# EAGLE design LTC6811_slave_12s_rev3 (EAGLE 9.3.0)
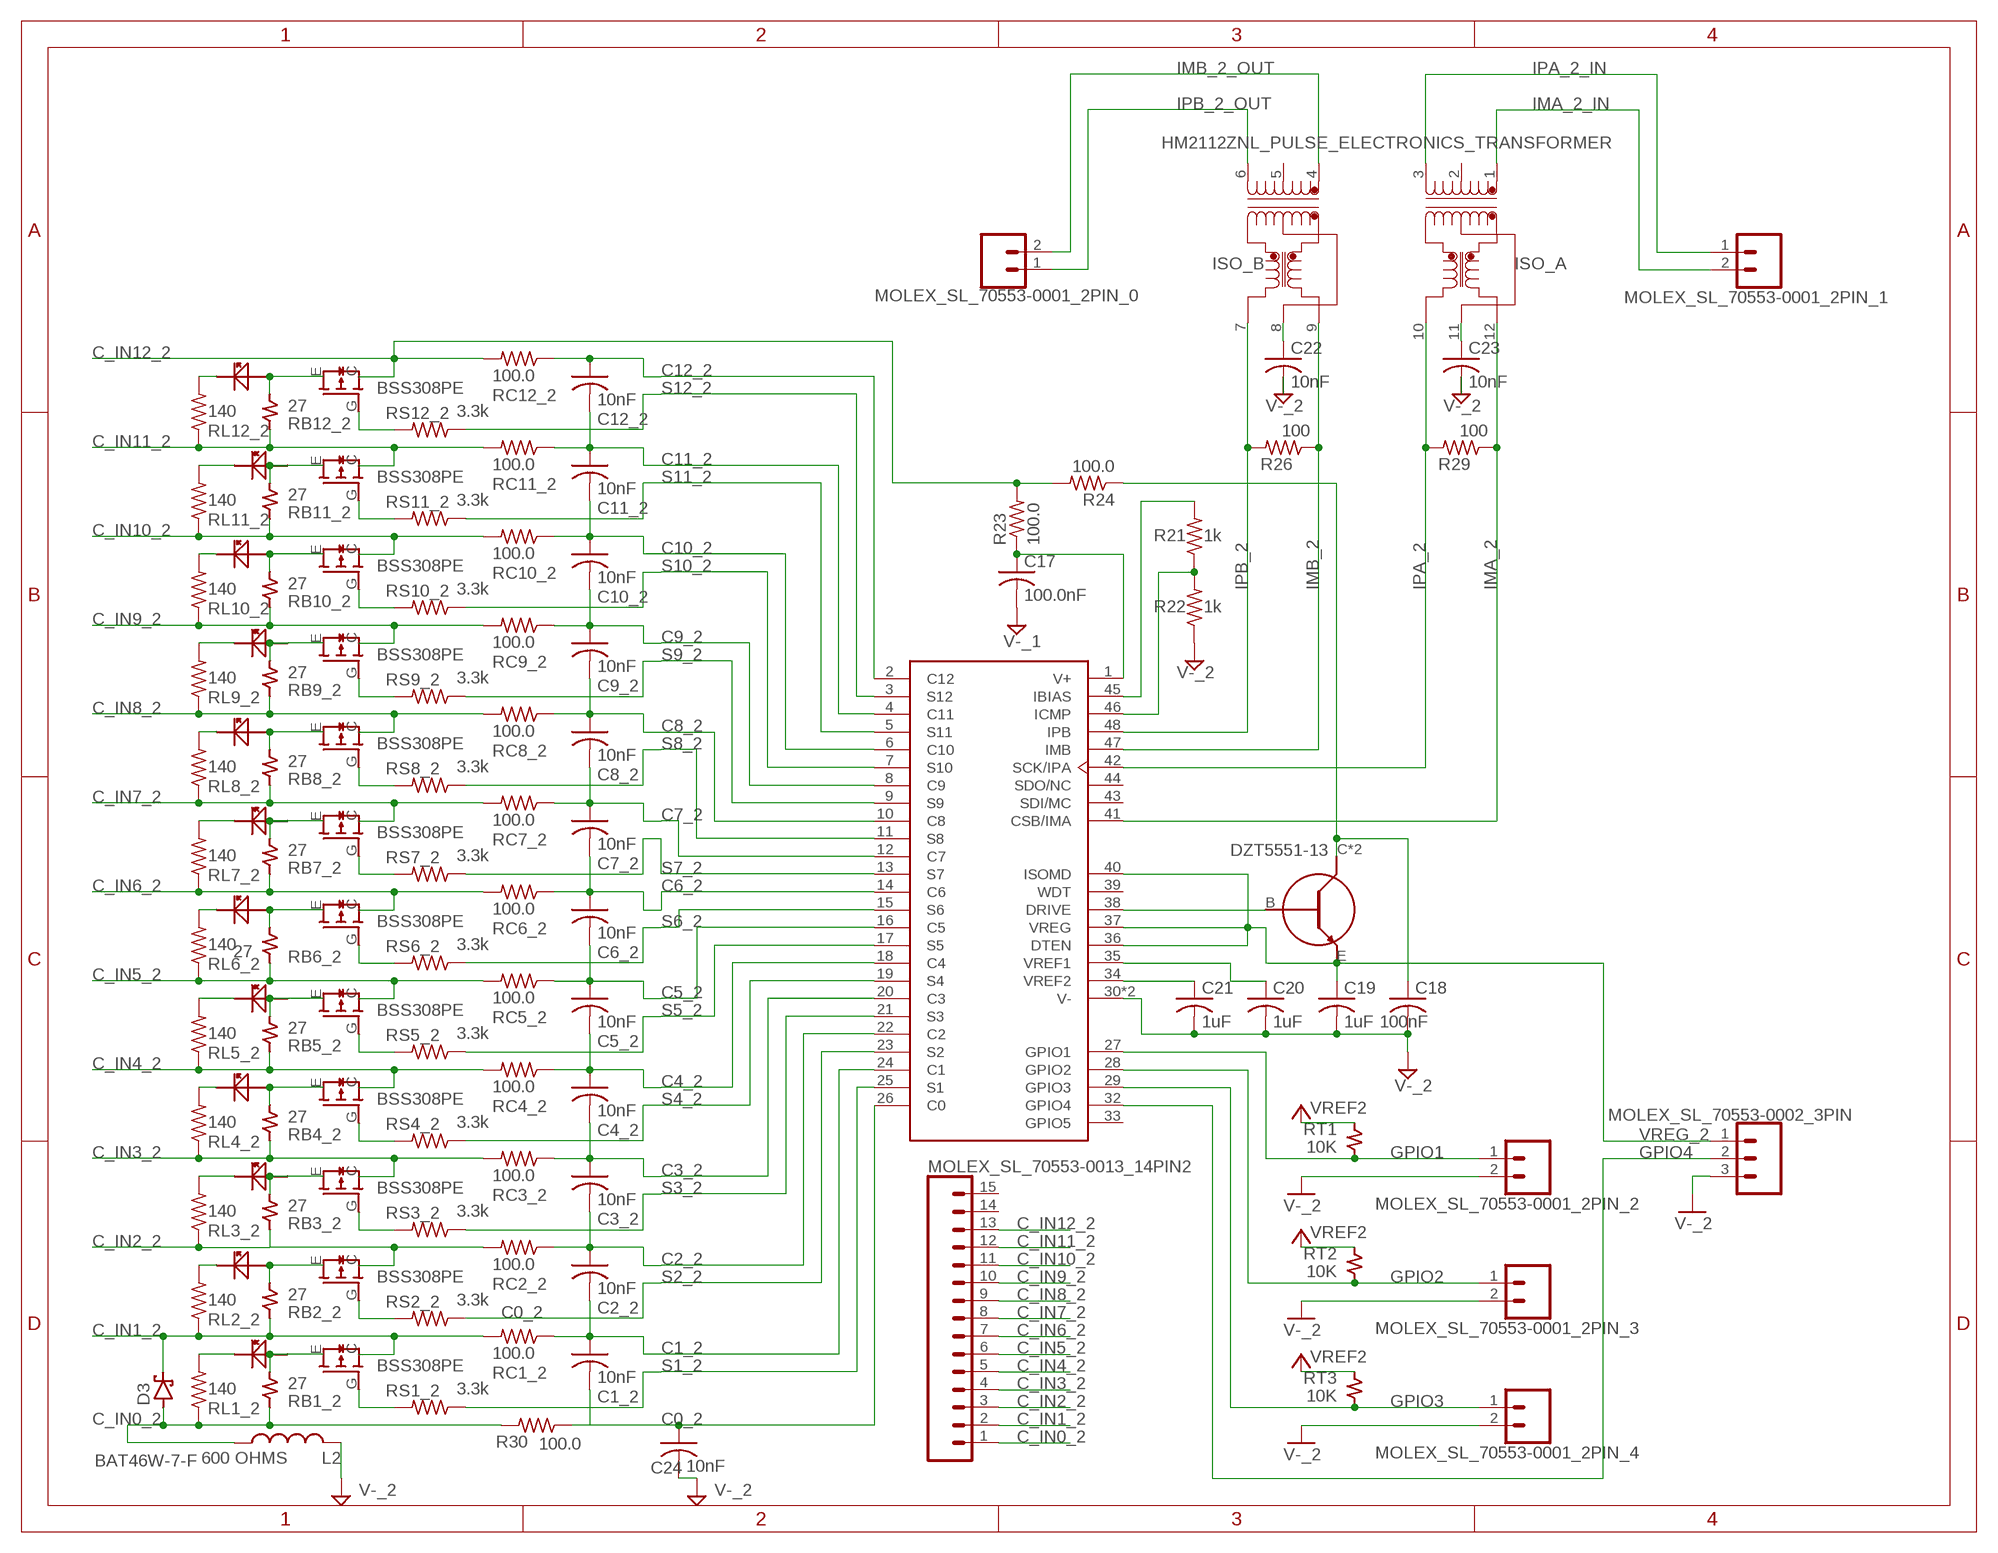
[diagram p0: schematic, sheet 1]

## Parts
C1_2  10nF  C-USC0805  [C0805]
C2_2  10nF  C-USC0805  [C0805]
C3_2  10nF  C-USC0805  [C0805]
C4_2  10nF  C-USC0805  [C0805]
C5_2  10nF  C-USC0805  [C0805]
C6_2  10nF  C-USC0805  [C0805]
C7_2  10nF  C-USC0805  [C0805]
C8_2  10nF  C-USC0805  [C0805]
C9_2  10nF  C-USC0805  [C0805]
C10_2  10nF  C-USC0805  [C0805]
C11_2  10nF  C-USC0805  [C0805]
C12_2  10nF  C-USC0805  [C0805]
C17  100.0nF  C-USC0805  [C0805]
C18  100nF  C-USC0805  [C0805]
C19  1uF  C-USC0805  [C0805]
C20  1uF  C-USC0805  [C0805]
C21  1uF  C-USC0805  [C0805]
C22  10nF  C-USC0805  [C0805]
C23  10nF  C-USC0805  [C0805]
C24  10nF  C-USC0805  [C0805]
D3  BAT46W-7-F  [SOD123]
DZT5551-2  DZT5551-13  [SOT223-4]
L2  600 OHMS  0805_FERRITEBEAD_INDUCTOR  [0805_COMPONENT]
LED1_25  LED_0805  [0805_COMPONENT]
LED1_26  LED_0805  [0805_COMPONENT]
LED1_27  LED_0805  [0805_COMPONENT]
LED1_28  LED_0805  [0805_COMPONENT]
LED1_29  LED_0805  [0805_COMPONENT]
LED1_30  LED_0805  [0805_COMPONENT]
LED1_31  LED_0805  [0805_COMPONENT]
LED1_32  LED_0805  [0805_COMPONENT]
LED1_33  LED_0805  [0805_COMPONENT]
LED1_34  LED_0805  [0805_COMPONENT]
LED1_35  LED_0805  [0805_COMPONENT]
LED1_36  LED_0805  [0805_COMPONENT]
MOLEX_SL_70553-0001_2PIN_0  CONN_02  [1X02]
MOLEX_SL_70553-0001_2PIN_1  CONN_02  [1X02]
MOLEX_SL_70553-0001_2PIN_2  CONN_02  [1X02]
MOLEX_SL_70553-0001_2PIN_3  CONN_02  [1X02]
MOLEX_SL_70553-0001_2PIN_4  CONN_02  [1X02]
MOLEX_SL_70553-0002_3PIN  CONN_03  [1X03]
MOLEX_SL_70553-0013_14PIN2  CONN_15  [1X15]
R21  1k  R-US_R0805  [R0805]
R22  1k  R-US_R0805  [R0805]
R23  100.0  R-US_R0805  [R0805]
R24  100.0  R-US_R0805  [R0805]
R26  100  R-US_R0805  [R0805]
R29  100  R-US_R0805  [R0805]
R30  100.0  R-US_R0805  [R0805]
RB1_2  27  2817_RESISTOR  [2817_COMPONENT]
RB2_2  27  2817_RESISTOR  [2817_COMPONENT]
RB3_2  27  2817_RESISTOR  [2817_COMPONENT]
RB4_2  27  2817_RESISTOR  [2817_COMPONENT]
RB5_2  27  2817_RESISTOR  [2817_COMPONENT]
RB6_2  27  2817_RESISTOR  [2817_COMPONENT]
RB7_2  27  2817_RESISTOR  [2817_COMPONENT]
RB8_2  27  2817_RESISTOR  [2817_COMPONENT]
RB9_2  27  2817_RESISTOR  [2817_COMPONENT]
RB10_2  27  2817_RESISTOR  [2817_COMPONENT]
RB11_2  27  2817_RESISTOR  [2817_COMPONENT]
RB12_2  27  2817_RESISTOR  [2817_COMPONENT]
RC1_2  100.0  R-US_R0805  [R0805]
RC2_2  100.0  R-US_R0805  [R0805]
RC3_2  100.0  R-US_R0805  [R0805]
RC4_2  100.0  R-US_R0805  [R0805]
RC5_2  100.0  R-US_R0805  [R0805]
RC6_2  100.0  R-US_R0805  [R0805]
RC7_2  100.0  R-US_R0805  [R0805]
RC8_2  100.0  R-US_R0805  [R0805]
RC9_2  100.0  R-US_R0805  [R0805]
RC10_2  100.0  R-US_R0805  [R0805]
RC11_2  100.0  R-US_R0805  [R0805]
RC12_2  100.0  R-US_R0805  [R0805]
RL1_2  140  R-US_R0805  [R0805]
RL2_2  140  R-US_R0805  [R0805]
RL3_2  140  R-US_R0805  [R0805]
RL4_2  140  R-US_R0805  [R0805]
RL5_2  140  R-US_R0805  [R0805]
RL6_2  140  R-US_R0805  [R0805]
RL7_2  140  R-US_R0805  [R0805]
RL8_2  140  R-US_R0805  [R0805]
RL9_2  140  R-US_R0805  [R0805]
RL10_2  140  R-US_R0805  [R0805]
RL11_2  140  R-US_R0805  [R0805]
RL12_2  140  R-US_R0805  [R0805]
RS1_2  3.3k  R-US_R0805  [R0805]
RS2_2  3.3k  R-US_R0805  [R0805]
RS3_2  3.3k  R-US_R0805  [R0805]
RS4_2  3.3k  R-US_R0805  [R0805]
RS5_2  3.3k  R-US_R0805  [R0805]
RS6_2  3.3k  R-US_R0805  [R0805]
RS7_2  3.3k  R-US_R0805  [R0805]
RS8_2  3.3k  R-US_R0805  [R0805]
RS9_2  3.3k  R-US_R0805  [R0805]
RS10_2  3.3k  R-US_R0805  [R0805]
RS11_2  3.3k  R-US_R0805  [R0805]
RS12_2  3.3k  R-US_R0805  [R0805]
RT1  10K  0805_RESISTOR  [0805_RESISTOR]
RT2  10K  0805_RESISTOR  [0805_RESISTOR]
RT3  10K  0805_RESISTOR  [0805_RESISTOR]
T1_25  BSS308PEH6327  [SOT23]
T1_26  BSS308PEH6327  [SOT23]
T1_27  BSS308PEH6327  [SOT23]
T1_28  BSS308PEH6327  [SOT23]
T1_29  BSS308PEH6327  [SOT23]
T1_30  BSS308PEH6327  [SOT23]
T1_31  BSS308PEH6327  [SOT23]
T1_32  BSS308PEH6327  [SOT23]
T1_33  BSS308PEH6327  [SOT23]
T1_34  BSS308PEH6327  [SOT23]
T1_35  BSS308PEH6327  [SOT23]
T1_36  BSS308PEH6327  [SOT23]
U3  LTC6811HG-2#PBF  [LTC6811-1]
U$3  HM2112ZNL_PULSE_ELECTRONICS_TRANSFORMER  [HM2112ZNL_12SMT]

## Nets
C0_2: C24.1 R30.1 U3.26(C0)
C1_2: C1_2.1 C2_2.2 RC1_2.1 U3.24(C1)
C2_2: C2_2.1 C3_2.2 RC2_2.1 U3.22(C2)
C3_2: C3_2.1 C4_2.2 RC3_2.1 U3.20(C3)
C4_2: C4_2.1 C5_2.2 RC4_2.1 U3.18(C4)
C5_2: C5_2.1 C6_2.2 RC5_2.1 U3.16(C5)
C6_2: C6_2.1 C7_2.2 RC6_2.1 U3.14(C6)
C7_2: C7_2.1 C8_2.2 RC7_2.1 U3.12(C7)
C8_2: C8_2.1 C9_2.2 RC8_2.1 U3.10(C8)
C9_2: C9_2.1 C10_2.2 RC9_2.1 U3.8(C9)
C10_2: C10_2.1 C11_2.2 RC10_2.1 U3.6(C10)
C11_2: C11_2.1 C12_2.2 RC11_2.1 U3.4(C11)
C12_2: C12_2.1 RC12_2.1 U3.2(C12)
C_IN0_2: D3.A L2.1 MOLEX_SL_70553-0013_14PIN2.1 R30.2 RB1_2.2 RL1_2.1
C_IN1_2: D3.C MOLEX_SL_70553-0013_14PIN2.2 RB2_2.2 RC1_2.2 RL2_2.1 T1_25.C
C_IN2_2: MOLEX_SL_70553-0013_14PIN2.3 RB3_2.2 RC2_2.2 RL3_2.1 T1_26.C
C_IN3_2: MOLEX_SL_70553-0013_14PIN2.4 RB4_2.2 RC3_2.2 RL4_2.1 T1_27.C
C_IN4_2: MOLEX_SL_70553-0013_14PIN2.5 RB5_2.2 RC4_2.2 RL5_2.1 T1_28.C
C_IN5_2: MOLEX_SL_70553-0013_14PIN2.6 RB6_2.2 RC5_2.2 RL6_2.1 T1_29.C
C_IN6_2: MOLEX_SL_70553-0013_14PIN2.7 RB7_2.2 RC6_2.2 RL7_2.1 T1_30.C
C_IN7_2: MOLEX_SL_70553-0013_14PIN2.8 RB8_2.2 RC7_2.2 RL8_2.1 T1_31.C
C_IN8_2: MOLEX_SL_70553-0013_14PIN2.9 RB9_2.2 RC8_2.2 RL9_2.1 T1_32.C
C_IN9_2: MOLEX_SL_70553-0013_14PIN2.10 RB10_2.2 RC9_2.2 RL10_2.1 T1_33.C
C_IN10_2: MOLEX_SL_70553-0013_14PIN2.11 RB11_2.2 RC10_2.2 RL11_2.1 T1_34.C
C_IN11_2: MOLEX_SL_70553-0013_14PIN2.12 RB12_2.2 RC11_2.2 RL12_2.1 T1_35.C
C_IN12_2: MOLEX_SL_70553-0013_14PIN2.13 R23.2 R24.2 RC12_2.2 T1_36.C
DRIVE_2: DZT5551-2.B U3.38(DRIVE)
GPIO1: MOLEX_SL_70553-0001_2PIN_2.1 RT1.P$2 U3.27(GPIO1)
GPIO2: MOLEX_SL_70553-0001_2PIN_3.1 RT2.P$2 U3.28(GPIO2)
GPIO3: MOLEX_SL_70553-0001_2PIN_4.1 RT3.P$2 U3.29(GPIO3)
GPIO4: MOLEX_SL_70553-0002_3PIN.2 U3.32(GPIO4)
IBIAS_2: R21.2 U3.45(IBIAS)
ICMP_2: R21.1 R22.2 U3.46(ICMP)
IMA_2: R29.1 U3.41(CSB/IMA) U$3.12
IMA_2_IN: MOLEX_SL_70553-0001_2PIN_1.2 U$3.1
IMB_2: R26.1 U3.47(IMB) U$3.9
IMB_2_OUT: MOLEX_SL_70553-0001_2PIN_0.2 U$3.4
IPA_2: R29.2 U3.42(SCK/IPA) U$3.10
IPA_2_IN: MOLEX_SL_70553-0001_2PIN_1.1 U$3.3
IPB_2: R26.2 U3.48(IPB) U$3.7
IPB_2_OUT: MOLEX_SL_70553-0001_2PIN_0.1 U$3.6
N$85: C17.1 R23.1 U3.1(V+)
N$86: C22.1 U$3.8
N$89: C23.1 U$3.11
N$90: LED1_25.2 RB1_2.1 T1_25.E
N$91: RS1_2.2 T1_25.G(B)
N$92: LED1_25.1 RL1_2.2
N$93: LED1_26.2 RB2_2.1 T1_26.E
N$94: RS2_2.2 T1_26.G(B)
N$95: LED1_26.1 RL2_2.2
N$96: C1_2.2
N$97: LED1_27.2 RB3_2.1 T1_27.E
N$98: RS3_2.2 T1_27.G(B)
N$99: LED1_27.1 RL3_2.2
N$100: LED1_28.2 RB4_2.1 T1_28.E
N$101: RS4_2.2 T1_28.G(B)
N$102: LED1_28.1 RL4_2.2
N$103: LED1_29.2 RB5_2.1 T1_29.E
N$104: RS5_2.2 T1_29.G(B)
N$105: LED1_29.1 RL5_2.2
N$106: LED1_30.2 RB6_2.1 T1_30.E
N$107: RS6_2.2 T1_30.G(B)
N$108: LED1_30.1 RL6_2.2
N$109: LED1_31.2 RB7_2.1 T1_31.E
N$110: RS7_2.2 T1_31.G(B)
N$111: LED1_31.1 RL7_2.2
N$112: LED1_32.2 RB8_2.1 T1_32.E
N$113: RS8_2.2 T1_32.G(B)
N$114: LED1_32.1 RL8_2.2
N$115: LED1_33.2 RB9_2.1 T1_33.E
N$116: RS9_2.2 T1_33.G(B)
N$117: LED1_33.1 RL9_2.2
N$118: LED1_34.2 RB10_2.1 T1_34.E
N$119: RS10_2.2 T1_34.G(B)
N$120: LED1_34.1 RL10_2.2
N$121: LED1_35.2 RB11_2.1 T1_35.E
N$122: RS11_2.2 T1_35.G(B)
N$123: LED1_35.1 RL11_2.2
N$124: LED1_36.2 RB12_2.1 T1_36.E
N$125: RS12_2.2 T1_36.G(B)
N$126: LED1_36.1 RL12_2.2
S1_2: RS1_2.1 U3.25(S1)
S2_2: RS2_2.1 U3.23(S2)
S3_2: RS3_2.1 U3.21(S3)
S4_2: RS4_2.1 U3.19(S4)
S5_2: RS5_2.1 U3.17(S5)
S6_2: RS6_2.1 U3.15(S6)
S7_2: RS7_2.1 U3.13(S7)
S8_2: RS8_2.1 U3.11(S8)
S9_2: RS9_2.1 U3.9(S9)
S10_2: RS10_2.1 U3.7(S10)
S11_2: RS11_2.1 U3.5(S11)
S12_2: RS12_2.1 U3.3(S12)
V-_2: C17.2 C18.2 C19.2 C20.2 C21.2 C22.2 C23.2 C24.2 L2.2 MOLEX_SL_70553-0001_2PIN_2.2 MOLEX_SL_70553-0001_2PIN_3.2 MOLEX_SL_70553-0001_2PIN_4.2 MOLEX_SL_70553-0002_3PIN.3 R22.1 U3.30(V-) U3.31(V-) ; supply symbol labelled V-_1, GND
VREF1_C4_2: C20.1 U3.35(VREF1)
VREF2_C5_2: C21.1 RT1.P$1 RT2.P$1 RT3.P$1 U3.34(VREF2) ; supply symbol labelled VREF2
VREG_2: C19.1 DZT5551-2.E MOLEX_SL_70553-0002_3PIN.1 U3.36(DTEN) U3.37(VREG) U3.40(ISOMD)
VREG_CAP_2: C18.1 DZT5551-2.C DZT5551-2.C@2(C) R24.1
Unconnected: MOLEX_SL_70553-0013_14PIN2.14 MOLEX_SL_70553-0013_14PIN2.15 U3.33(GPIO5) U3.39(WDT) U3.43(SDI/MC) U3.44(SDO/NC) U$3.2 U$3.5

## Notes on the sheet
- ISO_B | ISO_A
- DZT5551-13

## Library data of the parts
C1_2 C2_2 C3_2 C4_2 C5_2 C6_2 C7_2 C8_2 C9_2 C10_2 C11_2 C12_2 C17-C24 = resistor:C-US: CAPACITOR, American symbol
D3 = Library_Capstone:BAT46W-7-F
DZT5551-2 = Library_Capstone:DZT5551-13
L2 = Library_Capstone:0805_FERRITEBEAD_INDUCTOR
LED1_25-LED1_36 = Library_Capstone:LED_0805
MOLEX_SL_70553-0001_2PIN_0 MOLEX_SL_70553-0001_2PIN_1-MOLEX_SL_70553-0001_2PIN_4 = SparkFun-Connectors:CONN_02: Multi connection point. Often used as Generic Header-pin footprint for 0.1 inch spaced/style header connections On any of the 0.1 inch spaced packages, you can populate with these: Break Away Headers - Straight <https://www.sparkfun.com/products/116> (PRT-00116) Break Away Male Headers - Right Angle <https://www.sparkfun.com/products/553> (PRT-00553) Female Headers <https://www.sparkfun.com/products/115> (PRT-00115) Break Away Headers - Machine Pin <https://www.sparkfun.com/products/117> (PRT-00117) Break Away Female Headers - Swiss Machine Pin <https://www.sparkfun.com/products/743> (PRT-00743) For SCREWTERMINALS and SPRING TERMINALS visit here: Screw Terimnals on SparkFun.com <https://www.sparkfun.com/search/results?term=Screw+Terminals> (5mm/3.5mm/2.54mm spacing) This device is also useful as a general connection point to wire up your design to another part of your project. Our various solder wires solder well into these plated through hole pads. Hook-Up Wire - Assortment (Stranded, 22 AWG) <https://www.sparkfun.com/products/11375> (PRT-11375) Hook-Up Wire - Assortment (Solid Core, 22 AWG) <https://www.sparkfun.com/products/11367> (PRT-11367) View the entire wire category on our website here <https://www.sparkfun.com/categories/141> Special notes: Molex polarized connector foot print use with: PRT-08233 with associated crimp pins and housings. 2.54_SCREWTERM for use with PRT-10571. 3.5mm Screw Terminal footprints for PRT-08084 5mm Screw Terminal footprints for use with PRT-08432
MOLEX_SL_70553-0002_3PIN = SparkFun-Connectors:CONN_03: Multi connection point. Often used as Generic Header-pin footprint for 0.1 inch spaced/style header connections On any of the 0.1 inch spaced packages, you can populate with these: Break Away Headers - Straight <https://www.sparkfun.com/products/116> (PRT-00116) Break Away Male Headers - Right Angle <https://www.sparkfun.com/products/553> (PRT-00553) Female Headers <https://www.sparkfun.com/products/115> (PRT-00115) Break Away Headers - Machine Pin <https://www.sparkfun.com/products/117> (PRT-00117) Break Away Female Headers - Swiss Machine Pin <https://www.sparkfun.com/products/743> (PRT-00743) Stackable Header - 3 Pin (Female, 0.1") <https://www.sparkfun.com/products/13875> (PRT-13875) For SCREWTERMINALS and SPRING TERMINALS visit here: Screw Terimnals on SparkFun.com <https://www.sparkfun.com/search/results?term=Screw+Terminals> (5mm/3.5mm/2.54mm spacing) This device is also useful as a general connection point to wire up your design to another part of your project. Our various solder wires solder well into these plated through hole pads. Hook-Up Wire - Assortment (Stranded, 22 AWG) <https://www.sparkfun.com/products/11375> (PRT-11375) Hook-Up Wire - Assortment (Solid Core, 22 AWG) <https://www.sparkfun.com/products/11367> (PRT-11367) View the entire wire category on our website here <https://www.sparkfun.com/categories/141> Special notes: Molex polarized connector foot print use with SKU : PRT-08232 with associated crimp pins and housings.
MOLEX_SL_70553-0013_14PIN2 = SparkFun-Connectors:CONN_15: Multi connection point. Often used as Generic Header-pin footprint for 0.1 inch spaced/style header connections On any of the 0.1 inch spaced packages, you can populate with these: Break Away Headers - Straight <https://www.sparkfun.com/products/116> (PRT-00116) Break Away Male Headers - Right Angle <https://www.sparkfun.com/products/553> (PRT-00553) Female Headers <https://www.sparkfun.com/products/115> (PRT-00115) Break Away Headers - Machine Pin <https://www.sparkfun.com/products/117> (PRT-00117) Break Away Female Headers - Swiss Machine Pin <https://www.sparkfun.com/products/743> (PRT-00743) For SCREWTERMINALS and SPRING TERMINALS visit here: Screw Terimnals on SparkFun.com <https://www.sparkfun.com/search/results?term=Screw+Terminals> (5mm/3.5mm/2.54mm spacing) This device is also useful as a general connection point to wire up your design to another part of your project. Our various solder wires solder well into these plated through hole pads. Hook-Up Wire - Assortment (Stranded, 22 AWG) <https://www.sparkfun.com/products/11375> (PRT-11375) Hook-Up Wire - Assortment (Solid Core, 22 AWG) <https://www.sparkfun.com/products/11367> (PRT-11367) View the entire wire category on our website here <https://www.sparkfun.com/categories/141> Special notes: Molex polarized connector foot print use with SKU : PRT-08231 with associated crimp pins and housings. 1MM SMD Version SKU: PRT-10208 NOTES ON THE VARIANTS LOCK and LOCK_LONGPADS... This footprint was designed to help hold the alignment of a through-hole component (i.e. 6-pin header) while soldering it into place. You may notice that each hole has been shifted either up or down by 0.005 of an inch from it's more standard position (which is a perfectly straight line). This slight alteration caused the pins (the squares in the middle) to touch the edges of the holes. Because they are alternating, it causes a "brace" to hold the component in place. 0.005 has proven to be the perfect amount of "off-center" position when using our standard breakaway headers. Although looks a little odd when you look at the bare footprint, once you have a header in there, the alteration is very hard to notice. Also,if you push a header all the way into place, it is covered up entirely on the bottom side.
R21-R24 R26 R29 R30 RC1_2 RC2_2 RC3_2 RC4_2 RC5_2 RC6_2 RC7_2 RC8_2 RC9_2 RC10_2 RC11_2 RC12_2 RL1_2 RL2_2 RL3_2 RL4_2 RL5_2 RL6_2 RL7_2 RL8_2 RL9_2 RL10_2 RL11_2 RL12_2 RS1_2 RS2_2 RS3_2 RS4_2 RS5_2 RS6_2 RS7_2 RS8_2 RS9_2 RS10_2 RS11_2 RS12_2 = resistor:R-US_: RESISTOR, American symbol
RB1_2 RB2_2 RB3_2 RB4_2 RB5_2 RB6_2 RB7_2 RB8_2 RB9_2 RB10_2 RB11_2 RB12_2 = Library_Capstone:2817_RESISTOR
RT1-RT3 = Library_Capstone:0805_RESISTOR
T1_25-T1_36 = Library_Capstone:BSS308PEH6327
U3 = LTC6811HG-2_PBF:LTC6811HG-2#PBF: LTC6811-1/LTC6811-2 - Multicell Battery Monitors; AVAILABILITY: Unavailable; DESCRIPTION: LTC6811-1/LTC6811-2 - Multicell Battery Monitors; MF: Linear Technology/Analog; MP: LTC6811HG-2#PBF; PACKAGE: SSOP-48 Linear Technology; PRICE: None
U$3 = HM2112ZNL:HM2112ZNL_PULSE_ELECTRONICS_TRANSFORMER

## Board
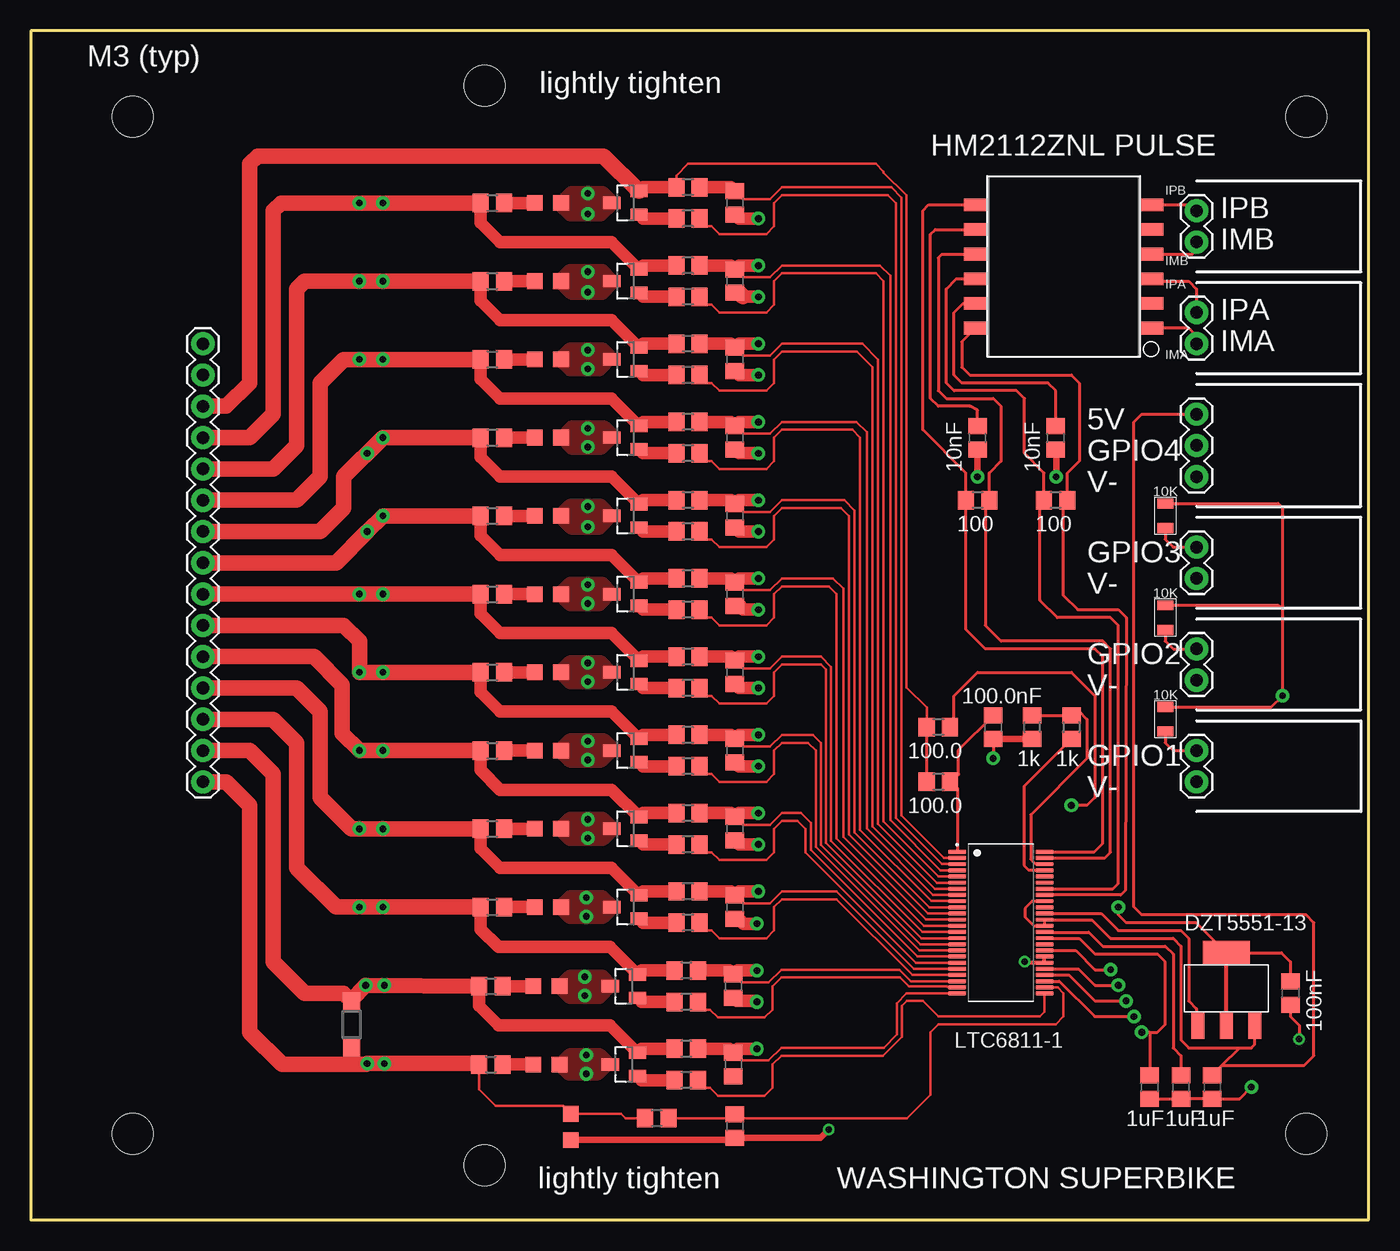
[diagram p1: board, top side]
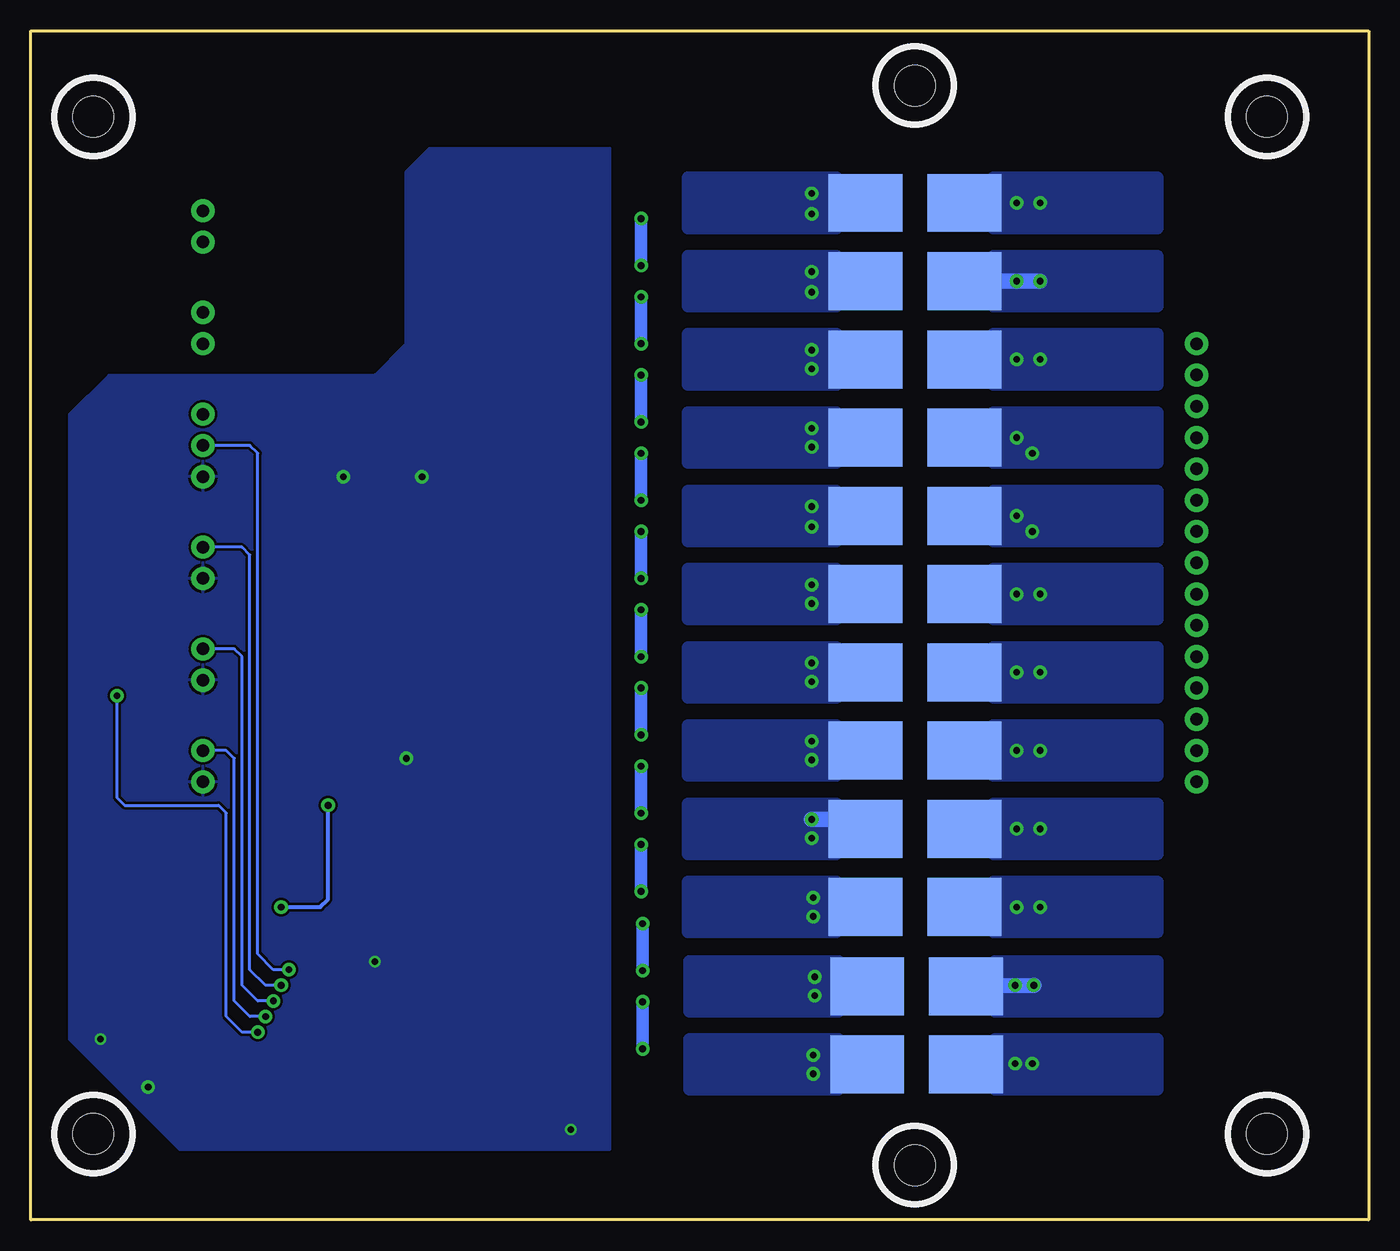
[diagram p2: board, bottom side, seen from below]

Size 108.58 x 96.52 mm. Coordinates in mm from the lower left corner, seen from the top.
Outline: 0,0 108.58,0 108.58,96.52 0,96.52 0,0
Copper layers (1*16): Top 0.035mm / dielectric 1.5mm / Bottom 0.035mm
Design rules "sierraDRC *": minimum track width 8mil, minimum drill 0.35mm, track to track 8mil, track to pad 6mil, pad to pad 6mil, via to via 8mil, smd to smd 6mil, copper to edge 40mil, drill to drill 10mil, minimum pad ring 10mil, minimum via ring 8mil, stop-mask expansion 3mil, vias tented up to drill 0mil, thermal gap 10mil
Holes 3.3 mm at 36.83,4.45 103.5,6.99 8.26,6.99 8.26,89.53 36.83,92.08 103.5,89.53

### Footprints (pad centres in the part's own frame; a part is rotated, then mirrored left to right if it is on the bottom)
C0805 = smd 1.3 x 1.5: 1 -0.95,0; 2 0.95,0
SOD123 = smd 1.4 x 1.4: A 1.9,0; C -1.9,0
SOT223-4 = smd 1.067 x 2.184: B -2.3,-3; C@2 0,-3; E 2.3,-3 | smd 3.81 x 1.93: C 0,2.9
0805_COMPONENT = smd 1.27 x 1.27: 1 -1,0; 2 1.127,0
1X02 = drill 1.016 pad 1.88: 1 0,0; 2 2.54,0
1X03 = drill 1.016 pad 1.88: 1 0,0; 2 2.54,0; 3 5.08,0
1X15 = drill 1.016 pad 1.88: 1 0,0; 2 2.54,0; 3 5.08,0; 4 7.62,0; 5 10.16,0; 6 12.7,0; 7 15.24,0; 8 17.78,0; 9 20.32,0; 10 22.86,0; 11 25.4,0; 12 27.94,0; 13 30.48,0; 14 33.02,0; 15 35.56,0
R0805 = smd 1.3 x 1.5: 1 -0.95,0; 2 0.95,0
2817_COMPONENT = smd 6 x 4.7: 1 -4,0; 2 4,0
0805_RESISTOR = smd 0.8 x 1.27: P$1 -1,0; P$2 1,0
SOT23 = smd 1 x 1.4: C 0.95,-1.1; E 0,1.1; G -0.95,-1.1
LTC6811-1 = smd 1.44 x 0.34: 1 -3.54,5.75; 2 -3.54,5.25; 3 -3.54,4.75; 4 -3.54,4.25; 5 -3.54,3.75; 6 -3.54,3.25; 7 -3.54,2.75; 8 -3.54,2.25; 9 -3.54,1.75; 10 -3.54,1.25; 11 -3.54,0.75; 12 -3.54,0.25; 13 -3.54,-0.25; 14 -3.54,-0.75; 15 -3.54,-1.25; 16 -3.54,-1.75; 17 -3.54,-2.25; 18 -3.54,-2.75; 19 -3.54,-3.25; 20 -3.54,-3.75; 21 -3.54,-4.25; 22 -3.54,-4.75; 23 -3.54,-5.25; 24 -3.54,-5.75; 25 3.54,-5.75; 26 3.54,-5.25; 27 3.54,-4.75; 28 3.54,-4.25; 29 3.54,-3.75; 30 3.54,-3.25; 31 3.54,-2.75; 32 3.54,-2.25; 33 3.54,-1.75; 34 3.54,-1.25; 35 3.54,-0.75; 36 3.54,-0.25; 37 3.54,0.25; 38 3.54,0.75; 39 3.54,1.25; 40 3.54,1.75; 41 3.54,2.25; 42 3.54,2.75; 43 3.54,3.25; 44 3.54,3.75; 45 3.54,4.25; 46 3.54,4.75; 47 3.54,5.25; 48 3.54,5.75
HM2112ZNL_12SMT = smd 1.02 x 1.89: 1 0,-7.145; 2 2,-7.145; 3 4,-7.145; 4 6,-7.145; 5 8,-7.145; 6 10,-7.145; 7 10,7.145; 8 8,7.145; 9 6,7.145; 10 4,7.145; 11 2,7.145; 12 0,7.145

### Placement (x,y rotation side)
C1_2  57.02,12.62 270 top
C2_2  57.02,18.97 270 top
C3_2  57.15,25.4 270 top
C4_2  57.15,31.75 270 top
C5_2  57.15,38.1 270 top
C6_2  57.15,44.45 270 top
C7_2  57.15,50.8 270 top
C8_2  57.15,57.15 270 top
C9_2  57.15,63.5 270 top
C10_2  57.15,69.85 270 top
C11_2  57.15,76.2 270 top
C12_2  57.15,82.55 270 top
C17  78.11,40.01 270 top
C18  102.23,18.41 270 top
C19  95.89,10.79 270 top
C20  93.34,10.79 270 top
C21  90.81,10.79 270 top
C22  76.83,63.5 270 top
C23  83.19,63.5 270 top
C24  57.15,7.62 270 top
D3  26.04,15.88 270 top
DZT5551-2  97.03,18.8 0 top
L2  43.81,7.62 270 top
LED1_25  41.78,12.62 0 top
LED1_26  41.78,18.97 0 top
LED1_27  41.91,25.4 0 top
LED1_28  41.91,31.75 0 top
LED1_29  41.91,38.1 0 top
LED1_30  41.91,44.45 0 top
LED1_31  41.91,50.8 0 top
LED1_32  41.91,57.15 0 top
LED1_33  41.91,63.5 0 top
LED1_34  41.91,69.85 0 top
LED1_35  41.91,76.2 0 top
LED1_36  41.91,82.55 0 top
MOLEX_SL_70553-0001_2PIN_0  94.61,81.92 270 top
MOLEX_SL_70553-0001_2PIN_1  94.61,73.66 270 top
MOLEX_SL_70553-0001_2PIN_2  94.61,38.1 270 top
MOLEX_SL_70553-0001_2PIN_3  94.61,46.35 270 top
MOLEX_SL_70553-0001_2PIN_4  94.61,54.61 270 top
MOLEX_SL_70553-0002_3PIN  94.61,65.41 270 top
MOLEX_SL_70553-0013_14PIN2  13.97,35.56 90 top
R21  84.45,40.01 270 top
R22  81.28,40.01 90 top
R23  73.66,35.56 180 top
R24  73.66,40.01 180 top
R26  76.83,58.42 180 top
R29  83.19,58.42 180 top
R30  50.8,8.26 180 top
RB1_2  36.7,12.62 0 bottom
RB2_2  36.7,18.97 0 bottom
RB3_2  36.83,25.4 0 bottom
RB4_2  36.83,31.75 0 bottom
RB5_2  36.83,38.1 0 bottom
RB6_2  36.83,44.45 0 bottom
RB7_2  36.83,50.8 0 bottom
RB8_2  36.83,57.15 0 bottom
RB9_2  36.83,63.5 0 bottom
RB10_2  36.83,69.85 0 bottom
RB11_2  36.83,76.2 0 bottom
RB12_2  36.83,82.55 0 bottom
RC1_2  53.21,13.89 180 top
RC2_2  53.21,20.24 180 top
RC3_2  53.34,26.67 180 top
RC4_2  53.34,33.02 180 top
RC5_2  53.34,39.37 180 top
RC6_2  53.34,45.72 180 top
RC7_2  53.34,52.07 180 top
RC8_2  53.34,58.42 180 top
RC9_2  53.34,64.77 180 top
RC10_2  53.34,71.12 180 top
RC11_2  53.34,77.47 180 top
RC12_2  53.34,83.82 180 top
RL1_2  37.34,12.62 0 top
RL2_2  37.34,18.97 0 top
RL3_2  37.47,25.4 0 top
RL4_2  37.47,31.75 0 top
RL5_2  37.47,38.1 0 top
RL6_2  37.47,44.45 0 top
RL7_2  37.47,50.8 0 top
RL8_2  37.47,57.15 0 top
RL9_2  37.47,63.5 0 top
RL10_2  37.47,69.85 0 top
RL11_2  37.47,76.2 0 top
RL12_2  37.47,82.55 0 top
RS1_2  53.21,11.35 180 top
RS2_2  53.21,17.7 180 top
RS3_2  53.34,24.13 180 top
RS4_2  53.34,30.48 180 top
RS5_2  53.34,36.83 180 top
RS6_2  53.34,43.18 180 top
RS7_2  53.34,49.53 180 top
RS8_2  53.34,55.88 180 top
RS9_2  53.34,62.23 180 top
RS10_2  53.34,68.58 180 top
RS11_2  53.34,74.93 180 top
RS12_2  53.34,81.28 180 top
RT1  92.08,40.64 270 top
RT2  92.08,48.9 270 top
RT3  92.08,57.15 270 top
T1_25  48.13,12.62 90 top
T1_26  48.13,18.97 90 top
T1_27  48.26,25.4 90 top
T1_28  48.26,31.75 90 top
T1_29  48.26,38.1 90 top
T1_30  48.26,44.45 90 top
T1_31  48.26,50.8 90 top
T1_32  48.26,57.15 90 top
T1_33  48.26,63.5 90 top
T1_34  48.26,69.85 90 top
T1_35  48.26,76.2 90 top
T1_36  48.26,82.55 90 top
U3  78.74,24.13 0 top
U$3  83.82,72.39 90 top

### Tracks (layer width: path | path; a pad name or v marks a point on that pad's centre or on a via)
C0_2
  Top 0.203: U3.26 83.36,18.88 83.82,18.41 83.82,16.51 83.19,15.88 73.66,15.88 73.03,15.24 73.03,10.16 71.12,8.26 57.47,8.26 C24.1 56.84,8.26 R30.1
C1_2  (via drill 0.55 pad 1.1)
  Top 0.203: C1_2.1 57.66,12.94 59.88,12.94 60.91,13.97 69.23,13.97 70.31,15.05 70.31,17.6 71.08,18.38 U3.24
  Top 1.016: RC1_2.1 56.7,13.89 C1_2.1 57.34,13.89 v58.93,13.89 | C2_2.2 57.27,17.78 58.85,17.78 v58.93,17.7
  Bottom 1.016: v58.93,13.89 v58.93,17.7
C2_2  (via drill 0.55 pad 1.1)
  Top 0.203: C2_2.1 57.66,19.29 59.88,19.29 60.91,20.32 70.48,20.32 71.42,19.38 U3.22
  Top 1.016: RC2_2.1 56.7,20.24 C2_2.1 57.34,20.24 v58.93,20.24 | C3_2.2 57.47,24.45 57.86,24.05 v58.93,24.05
  Bottom 1.016: v58.93,20.24 v58.93,24.05
C3_2  (via drill 0.55 pad 1.1)
  Top 0.203: C3_2.1 57.78,25.71 60.01,25.71 60.96,26.67 65.41,26.67 71.69,20.38 U3.20
  Top 1.016: RC3_2.1 56.83,26.67 C3_2.1 57.47,26.67 v59.05,26.67 | C4_2.2 57.47,30.48 v59.05,30.48
  Bottom 1.016: v59.05,26.67 v59.05,30.48
C4_2  (via drill 0.55 pad 1.1)
  Top 0.203: C4_2.1 57.78,32.06 60.01,32.06 60.96,33.02 62.52,33.02 63.32,32.22 63.32,30.02 71.97,21.38 U3.18
  Top 1.016: RC4_2.1 56.83,33.02 C4_2.1 57.47,33.02 v59.05,33.02 | C5_2.2 57.47,36.83 v59.05,36.83
  Bottom 1.016: v59.05,33.02 v59.05,36.83
C5_2  (via drill 0.55 pad 1.1)
  Top 0.203: C5_2.1 57.78,38.41 60.01,38.41 60.96,39.37 63.5,39.37 64.14,38.73 64.14,30.45 72.2,22.38 U3.16
  Top 1.016: RC5_2.1 56.83,39.37 C5_2.1 57.47,39.37 v59.05,39.37 | C6_2.2 57.47,43.18 v59.05,43.18
  Bottom 1.016: v59.05,39.37 v59.05,43.18
C6_2  (via drill 0.55 pad 1.1)
  Top 0.203: C6_2.1 57.78,44.77 60.01,44.77 60.96,45.72 64.12,45.72 64.95,44.9 64.95,30.79 72.35,23.38 U3.14
  Top 1.016: RC6_2.1 56.83,45.72 C6_2.1 57.47,45.72 v59.05,45.72 | 57.47,49.85 57.78,49.53 v59.05,49.53
  Top 1.27: C7_2.2 57.47,49.85
  Bottom 1.016: v59.05,45.72 v59.05,49.53
C7_2  (via drill 0.55 pad 1.1)
  Top 0.203: C7_2.1 57.78,51.12 60.01,51.12 60.96,52.07 65.11,52.07 65.94,51.25 65.94,31.09 72.65,24.38 U3.12
  Top 1.016: RC7_2.1 56.83,52.07 C7_2.1 57.47,52.07 v59.05,52.07 | C8_2.2 57.47,55.88 v59.05,55.88
  Bottom 1.016: v59.05,52.07 v59.05,55.88
C8_2  (via drill 0.55 pad 1.1)
  Top 0.203: C8_2.1 57.78,57.47 60.01,57.47 60.96,58.42 66.03,58.42 66.85,57.6 66.85,31.47 72.94,25.38 | U3.10 72.94,25.38 | 72.94,25.38
  Top 1.016: RC8_2.1 56.83,58.42 C8_2.1 57.47,58.42 v59.05,58.42 | C9_2.2 57.47,62.23 v59.05,62.23
  Bottom 1.016: v59.05,58.42 v59.05,62.23
C9_2  (via drill 0.55 pad 1.1)
  Top 0.203: C9_2.1 57.78,63.81 60.01,63.81 60.96,64.77 67.02,64.77 67.84,63.95 67.84,31.77 73.23,26.38 U3.8
  Top 1.016: RC9_2.1 56.83,64.77 C9_2.1 57.47,64.77 v59.05,64.77 | C10_2.2 57.47,68.58 v59.05,68.58
  Bottom 1.016: v59.05,64.77 v59.05,68.58
C10_2  (via drill 0.55 pad 1.1)
  Top 0.203: C10_2.1 57.78,70.17 60.01,70.17 60.96,71.12 67.49,71.12 68.76,69.85 68.76,32.15 73.53,27.38 U3.6
  Top 1.016: RC10_2.1 56.83,71.12 C10_2.1 57.47,71.12 v59.05,71.12 | 57.78,74.93 v59.05,74.93
  Top 1.27: C11_2.2 57.47,75.25 57.78,74.93
  Bottom 1.016: v59.05,71.12 v59.05,74.93
C11_2  (via drill 0.55 pad 1.1)
  Top 0.203: C11_2.1 57.78,76.52 60.01,76.52 60.96,77.47 68.92,77.47 69.75,76.65 69.75,32.45 73.82,28.38 U3.4
  Top 1.016: RC11_2.1 56.83,77.47 C11_2.1 57.47,77.47 v59.05,77.47 | C12_2.2 57.47,81.28 v59.05,81.28
  Bottom 1.016: v59.05,77.47 v59.05,81.28
C12_2
  Top 0.203: C12_2.1 57.78,82.86 60.01,82.86 60.96,83.82 69.84,83.82 70.66,83 70.66,32.83 74.11,29.38 U3.2
  Top 1.016: RC12_2.1 56.83,83.82 C12_2.1
C_IN0_2  (via drill 0.55 pad 1.1)
  Top 0.203: RL1_2.1 36.39,10.6 37.73,9.26 43.18,9.26 L2.1 47.9,8.62 48.26,8.26 R30.2
  Top 1.27: MOLEX_SL_70553-0013_14PIN2.1 15.88,35.56 17.78,33.66 17.78,15.24 20.4,12.62 26.04,12.62 | D3.A 26.04,12.62 | 26.04,12.62 27.23,12.62 v27.3,12.7 v28.7,12.7 36.31,12.7 RL1_2.1
  pour Bottom (no thermals): 30.35,10.59 30.35,14.66 17.14,14.66 17.14,10.59
C_IN1_2  (via drill 0.55 pad 1.1)
  Top 1.016: RC1_2.2 49.55,13.89 T1_25.C 47.01,15.8 37.97,15.8 36.39,17.38 RL2_2.1
  Top 1.27: RL2_2.1 v27.18,19.05 26.04,17.86 D3.C 25.39,18.41 22.23,18.41 19.68,20.95 19.68,36.2 17.78,38.1 MOLEX_SL_70553-0013_14PIN2.2
  Bottom 1.27: RB2_2.2 v27.18,19.05
  other vias: 28.7,19.05
  pour Bottom (no thermals): 30.35,21.01 17.14,21.01 17.14,16.94 30.35,16.94
C_IN2_2  (via drill 0.55 pad 1.1)
  Top 1.016: RC2_2.2 49.55,20.24 T1_26.C 47.01,22.15 37.97,22.15 36.52,23.61 RL3_2.1
  Top 1.27: MOLEX_SL_70553-0013_14PIN2.3 19.68,40.64 21.59,38.73 21.59,28.57 24.77,25.4 v26.67,25.4 RL3_2.1
  other vias: 28.57,25.4
  pour Bottom (no thermals): 30.48,23.37 30.48,27.43 17.14,27.43 17.14,23.37
C_IN3_2  (via drill 0.55 pad 1.1)
  Top 1.016: RC3_2.2 49.68,26.67 T1_27.C 47.13,28.57 38.1,28.57 36.52,30.16 RL4_2.1
  Top 1.27: MOLEX_SL_70553-0013_14PIN2.4 21.59,43.18 23.5,41.27 23.5,34.29 26.04,31.75 v26.67,31.75 RL4_2.1
  other vias: 28.57,31.75
  pour Bottom (no thermals): 30.48,33.78 17.14,33.78 17.14,29.72 30.48,29.72
C_IN4_2  (via drill 0.55 pad 1.1)
  Top 1.016: RC4_2.2 49.68,33.02 T1_28.C 47.13,34.92 38.1,34.92 36.52,36.51 RL5_2.1
  Top 1.27: MOLEX_SL_70553-0013_14PIN2.5 22.99,45.72 25.27,43.43 25.27,39.5 v26.67,38.1 RL5_2.1
  other vias: 28.57,38.1
  pour Bottom (no thermals): 30.48,36.07 30.48,40.13 17.14,40.13 17.14,36.07
C_IN5_2  (via drill 0.55 pad 1.1)
  Top 1.016: RC5_2.2 49.68,39.37 T1_29.C 47.13,41.27 38.1,41.27 36.52,42.86 RL6_2.1
  Top 1.27: MOLEX_SL_70553-0013_14PIN2.6 25.4,48.26 26.67,46.99 v26.67,44.45 RL6_2.1
  other vias: 28.57,44.45
  pour Bottom (no thermals): 30.48,46.48 17.14,46.48 17.14,42.42 30.48,42.42
C_IN6_2  (via drill 0.55 pad 1.1)
  Top 1.016: RC6_2.2 49.68,45.72 T1_30.C 47.13,47.62 38.1,47.62 36.52,49.21 RL7_2.1
  Top 1.27: MOLEX_SL_70553-0013_14PIN2.7 v28.57,50.8 RL7_2.1
  other vias: 26.67,50.8
  pour Bottom (no thermals): 30.48,48.77 30.48,52.83 17.14,52.83 17.14,48.77
C_IN7_2  (via drill 0.55 pad 1.1)
  Top 1.016: RC7_2.2 49.68,52.07 T1_31.C 47.13,53.98 38.1,53.98 36.52,55.56 RL8_2.1
  Top 1.27: MOLEX_SL_70553-0013_14PIN2.8 24.77,53.34 v27.3,55.88 v28.57,57.15 RL8_2.1
  pour Bottom (no thermals): 30.48,59.18 17.14,59.18 17.14,55.12 30.48,55.12
C_IN8_2  (via drill 0.55 pad 1.1)
  Top 1.016: RC8_2.2 49.68,58.42 T1_32.C 47.13,60.33 38.1,60.33 36.52,61.91 RL9_2.1
  Top 1.27: MOLEX_SL_70553-0013_14PIN2.9 23.5,55.88 25.4,57.78 25.4,60.33 v28.57,63.5 RL9_2.1
  other vias: 27.3,62.23
  pour Bottom (no thermals): 30.48,61.47 30.48,65.53 17.14,65.53 17.14,61.47
C_IN9_2  (via drill 0.55 pad 1.1)
  Top 1.016: RC9_2.2 49.68,64.77 T1_33.C 47.13,66.67 38.1,66.67 36.52,68.26 RL10_2.1
  Top 1.27: MOLEX_SL_70553-0013_14PIN2.10 21.59,58.42 23.5,60.33 23.5,67.94 25.4,69.85 v26.67,69.85 RL10_2.1
  other vias: 28.57,69.85
  pour Bottom (no thermals): 30.48,71.88 17.14,71.88 17.14,67.82 30.48,67.82
C_IN10_2  (via drill 0.55 pad 1.1)
  Top 1.016: RC10_2.2 49.68,71.12 T1_34.C 47.13,73.03 38.1,73.03 36.52,74.61 RL11_2.1
  Top 1.27: RL11_2.1 v26.67,76.2 22.23,76.2 21.59,75.56 21.59,62.87 19.68,60.96 MOLEX_SL_70553-0013_14PIN2.11
  Bottom 1.27: v26.67,76.2 RB11_2.2
  other vias: 28.57,76.2
  pour Bottom (no thermals): 30.48,74.17 30.48,78.23 17.14,78.23 17.14,74.17
C_IN11_2  (via drill 0.55 pad 1.1)
  Top 1.016: RC11_2.2 49.68,77.47 T1_35.C 47.13,79.38 38.1,79.38 36.52,80.96 RL12_2.1
  Top 1.27: MOLEX_SL_70553-0013_14PIN2.12 17.78,63.5 19.68,65.41 19.68,81.92 20.32,82.55 v26.67,82.55 RL12_2.1
  other vias: 28.57,82.55
  pour Bottom (no thermals): 30.48,84.58 17.14,84.58 17.14,80.52 30.48,80.52
C_IN12_2
  Top 0.203: R24.2 72.71,41.59 71.07,43.23 71.07,83.16 69.22,85.02 69.22,85.09 68.58,85.72 53.34,85.72 52.39,84.78 RC12_2.2
  Top 0.254: R23.2 R24.2
  Top 1.016: RC12_2.2 49.68,83.82 T1_36.C
  Top 1.27: T1_36.C 46.5,86.36 18.41,86.36 17.78,85.72 17.78,67.94 15.88,66.04 MOLEX_SL_70553-0013_14PIN2.13
DRIVE_2
  Top 0.254: U3.38 86.88,24.88 88.27,23.5 93.34,23.5 93.98,22.86 93.98,17.78 94.61,17.14 94.61,15.91 DZT5551-2.B
GPIO1  (via drill 0.55 pad 1.1)
  Top 0.254: U3.27 83.48,19.38 86.35,16.51 v89.53,16.51 | RT1.P$2 92.08,38.73 92.71,38.1 MOLEX_SL_70553-0001_2PIN_2.1
  Bottom 0.254: v89.53,16.51 90.81,16.51 92.08,17.78 92.08,37.47 92.71,38.1 MOLEX_SL_70553-0001_2PIN_2.1
GPIO2  (via drill 0.55 pad 1.1)
  Top 0.254: U3.28 84.26,19.88 86.36,17.78 v88.9,17.78 | RT2.P$2 92.08,46.99 92.71,46.35 MOLEX_SL_70553-0001_2PIN_3.1
  Bottom 0.254: v88.9,17.78 90.17,17.78 91.44,19.05 91.44,45.72 92.08,46.35 MOLEX_SL_70553-0001_2PIN_3.1
GPIO3  (via drill 0.55 pad 1.1)
  Top 0.254: v88.27,19.05 86.36,19.05 86.36,19.06 85.04,20.38 U3.29 | RT3.P$2 92.08,55.24 92.71,54.61 MOLEX_SL_70553-0001_2PIN_4.1
  Bottom 0.254: v88.27,19.05 89.53,19.05 90.81,20.32 90.81,53.98 91.44,54.61 MOLEX_SL_70553-0001_2PIN_4.1
GPIO4  (via drill 0.55 pad 1.1)
  Top 0.254: U3.32 84.8,21.88 86.36,20.32 v87.63,20.32
  Bottom 0.254: v87.63,20.32 88.9,20.32 90.17,21.59 90.17,62.23 90.81,62.87 MOLEX_SL_70553-0002_3PIN.2
IBIAS_2
  Top 0.254: U3.45 81.01,28.38 80.6,28.79 80.6,35.2 R21.2
ICMP_2
  Top 0.203: 82.24,28.92 U3.46
  Top 0.254: R22.2 R21.1 | 85.09,41.27 85.72,40.64 85.72,37.47 81.15,32.89 81.15,29.28 81.51,28.92 82.24,28.92
  Top 0.305: 85.09,41.27 R21.1
IMA_2
  Top 0.254: U3.41 88.46,26.38 88.82,26.75 88.9,48.9 88.27,49.53 84.96,49.53 83.82,50.67 83.82,58.1 R29.1 84.14,60.64 85.09,61.59 85.09,67.94 84.45,68.58 76.2,68.58 75.56,69.22 75.56,71.28 U$3.12
IMA_2_IN
  Top 0.254: U$3.1 93.98,72.39 94.61,71.75 MOLEX_SL_70553-0001_2PIN_1.2
IMB_2
  Top 0.254: U3.47 87.17,29.38 87.63,29.84 87.63,46.35 87,46.99 78.74,46.99 77.47,48.26 77.47,57.78 | R26.1 77.78,60.64 78.74,61.59 78.74,66.04 78.11,66.67 74.3,66.67 73.66,67.31 73.66,78.11 73.94,78.39 U$3.9
  Top 0.305: R26.1 77.47,57.78
IMB_2_OUT
  Top 0.254: U$3.4 94.27,78.39 94.61,78.74 MOLEX_SL_70553-0001_2PIN_0.2
IPA_2
  Top 0.254: U3.42 87.84,26.88 88.27,27.3 88.27,48.26 87.63,48.9 83.31,48.9 81.92,50.29 81.92,58.1 R29.2 82.23,60.64 80.64,62.23 80.64,66.67 80.01,67.31 74.93,67.31 74.3,67.94 74.3,75.56 75.12,76.39 U$3.10
IPA_2_IN
  Top 0.254: U$3.3 91.16,76.2 93.98,76.2 94.61,75.56 MOLEX_SL_70553-0001_2PIN_1.1
IPB_2
  Top 0.254: U3.48 86.33,29.88 87,30.55 87,45.72 86.36,46.35 77.47,46.35 75.89,47.94 R26.2 75.89,60.64 72.39,64.14 72.39,81.92 72.86,82.39 U$3.7
IPB_2_OUT
  Top 0.254: U$3.6 94.14,82.39 MOLEX_SL_70553-0001_2PIN_0.1
N$85
  Top 0.254: C17.1 75.25,38.09 75.25,36.2 | 75.2,34.97 U3.1
  Top 0.305: 75.25,36.2 R23.1 75.2,34.97
N$86
  Top 0.254: C22.1 76.83,65.72 76.2,66.04 73.66,66.04 73.03,66.67 73.03,80.01 73.41,80.39 U$3.8
N$89
  Top 0.254: U$3.11 75.66,74.39 74.93,73.66 74.93,68.58 75.56,67.94 82.55,67.94 83.19,67.31 C23.1
N$90  (via drill 0.55 pad 1.1)
  other vias: 45.09,13.39 45.09,11.86
  pour Bottom (no thermals): 43.05,14.66 55.12,14.66 55.12,10.59 43.05,10.59
  pour Top (no thermals): 43.05,12.57 43.81,13.34 46.1,13.34 46.74,12.7 45.97,11.94 43.69,11.94
N$91
  Top 1.016: T1_25.G 49.55,11.35 RS1_2.2
N$92
  Top 1.016: RL1_2.2 LED1_25.1
N$93  (via drill 0.55 pad 1.1)
  other vias: 44.96,19.74 44.96,18.21
  pour Bottom (no thermals): 43.05,21.01 55.12,21.01 55.12,16.94 43.05,16.94
  pour Top (no thermals): 43.05,18.92 43.81,19.68 46.35,19.68 46.99,19.05 46.1,18.16 43.81,18.16
N$94
  Top 1.016: T1_26.G 49.55,17.7 RS2_2.2
N$95
  Top 1.016: RL2_2.2 LED1_26.1
N$97  (via drill 0.55 pad 1.1)
  other vias: 45.09,26.16 45.09,24.64
  pour Bottom (no thermals): 43.18,27.43 55.24,27.43 55.24,23.37 43.18,23.37
  pour Top (no thermals): 43.05,25.4 43.81,26.16 46.35,26.16 47.12,25.4 46.35,24.64 43.81,24.64
N$98
  Top 1.016: T1_27.G 49.68,24.13 RS3_2.2
N$99
  Top 1.016: RL3_2.2 LED1_27.1
N$100  (via drill 0.55 pad 1.1)
  Bottom 1.27: v45.21,32.51 41.59,32.51 RB4_2.1
  other vias: 45.21,30.99
  pour Bottom (no thermals): 43.18,33.78 55.24,33.78 55.24,29.72 43.18,29.72
  pour Top (no thermals): 43.05,31.75 43.81,32.51 46.35,32.51 47.12,31.75 46.35,30.99 43.81,30.99
N$101
  Top 1.016: T1_28.G 49.68,30.48 RS4_2.2
N$102
  Top 1.016: RL4_2.2 LED1_28.1
N$103  (via drill 0.55 pad 1.1)
  other vias: 45.21,38.86 45.21,37.34
  pour Bottom (no thermals): 43.18,40.13 55.24,40.13 55.24,36.07 43.18,36.07
  pour Top (no thermals): 43.05,38.1 43.81,38.86 46.48,38.86 47.12,38.23 46.23,37.34 43.81,37.34
N$104
  Top 1.016: T1_29.G 49.68,36.83 RS5_2.2
N$105
  Top 1.016: RL5_2.2 LED1_29.1
N$106  (via drill 0.55 pad 1.1)
  other vias: 45.21,45.21 45.21,43.69
  pour Bottom (no thermals): 43.18,46.48 55.24,46.48 55.24,42.42 43.18,42.42
  pour Top (no thermals): 43.05,44.45 43.81,45.21 46.23,45.21 46.99,44.45 46.23,43.69 43.81,43.69
N$107
  Top 1.016: T1_30.G 49.68,43.18 RS6_2.2
N$108
  Top 1.016: RL6_2.2 LED1_30.1
N$109  (via drill 0.55 pad 1.1)
  other vias: 45.21,51.56 45.21,50.04
  pour Bottom (no thermals): 43.18,52.83 55.24,52.83 55.24,48.77 43.18,48.77
  pour Top (no thermals): 43.05,50.8 43.81,51.56 46.35,51.56 46.99,50.93 46.1,50.04 43.81,50.04
N$110
  Top 1.016: T1_31.G 49.68,49.53 RS7_2.2
N$111
  Top 1.016: RL7_2.2 LED1_31.1
N$112  (via drill 0.55 pad 1.1)
  other vias: 45.21,57.91 45.21,56.26
  pour Bottom (no thermals): 43.18,59.18 55.24,59.18 55.24,55.12 43.18,55.12
  pour Top (no thermals): 43.05,57.15 43.81,57.91 46.23,57.91 46.99,57.15 46.1,56.26 43.94,56.26
N$113
  Top 1.016: T1_32.G 49.68,55.88 RS8_2.2
N$114
  Top 1.016: RL8_2.2 LED1_32.1
N$115  (via drill 0.55 pad 1.1)
  other vias: 45.21,64.26 45.21,62.74
  pour Bottom (no thermals): 43.18,65.53 55.24,65.53 55.24,61.47 43.18,61.47
  pour Top (no thermals): 43.18,63.5 43.94,64.26 46.48,64.26 47.12,63.63 46.23,62.74 43.94,62.74
N$116
  Top 1.016: T1_33.G 49.68,62.23 RS9_2.2
N$117
  Top 1.016: RL9_2.2 LED1_33.1
N$118  (via drill 0.55 pad 1.1)
  other vias: 45.21,70.61 45.21,69.09
  pour Bottom (no thermals): 43.18,71.88 55.24,71.88 55.24,67.82 43.18,67.82
  pour Top (no thermals): 46.1,69.09 43.81,69.09 43.05,69.85 43.81,70.61 46.35,70.61 46.99,69.98
N$119
  Top 1.016: T1_34.G 49.68,68.58 RS10_2.2
N$120
  Top 1.016: RL10_2.2 LED1_34.1
N$121  (via drill 0.55 pad 1.1)
  other vias: 45.21,76.96 45.21,75.31
  pour Bottom (no thermals): 43.18,78.23 55.24,78.23 55.24,74.17 43.18,74.17
  pour Top (no thermals): 43.05,76.2 43.81,76.96 46.35,76.96 46.99,76.33 46.99,75.95 46.35,75.31 43.94,75.31
N$122
  Top 1.016: T1_35.G 49.68,74.93 RS11_2.2
N$123
  Top 1.016: RL11_2.2 LED1_35.1
N$124  (via drill 0.55 pad 1.1)
  other vias: 45.21,83.31 45.21,81.66
  pour Bottom (no thermals): 43.18,84.58 55.24,84.58 55.24,80.52 43.18,80.52
  pour Top (no thermals): 43.05,82.42 43.94,83.31 46.35,83.31 47.12,82.55 46.23,81.66 43.81,81.66
N$125
  Top 1.016: T1_36.G 49.68,81.28 RS12_2.2
N$126
  Top 1.016: RL12_2.2 LED1_36.1
S1_2
  Top 0.203: RS1_2.1 54.8,10.72 55.12,10.72 55.75,10.08 59.56,10.08 60.2,10.72 60.2,12.62 60.91,13.34 69.17,13.34 70.71,14.88 70.71,17.37 71.12,17.78 72.39,17.78 73.66,16.51 81.92,16.51 82.28,16.88 U3.25
S2_2
  Top 0.203: RS2_2.1 54.8,17.07 55.12,17.07 55.75,16.43 59.56,16.43 60.2,17.07 60.2,18.97 60.91,19.68 70.55,19.68 71.27,18.96 74.36,18.96 74.41,18.91 75.17,18.91 U3.23
S3_2
  Top 0.203: RS3_2.1 54.92,23.5 55.24,23.5 55.88,22.86 59.69,22.86 60.33,23.5 60.33,25.4 60.96,26.04 65.41,26.04 71.56,19.88 U3.21
S4_2
  Top 0.203: RS4_2.1 54.92,29.84 55.24,29.84 55.88,29.21 59.69,29.21 60.33,29.84 60.33,31.75 60.96,32.38 62.23,32.38 62.87,31.75 62.87,29.84 71.83,20.88 U3.19
S5_2
  Top 0.203: RS5_2.1 54.92,36.2 55.24,36.2 55.88,35.56 59.69,35.56 60.33,36.2 60.33,38.1 60.96,38.73 63.09,38.73 63.73,38.1 63.73,30.28 72.13,21.88 U3.17
S6_2
  Top 0.203: RS6_2.1 54.92,42.55 55.24,42.55 55.88,41.91 59.69,41.91 60.33,42.55 60.33,44.45 60.96,45.09 64.14,45.09 64.54,44.68 64.54,30.62 72.3,22.86 75.18,22.86 U3.15
S7_2
  Top 0.203: RS7_2.1 54.92,48.9 55.24,48.9 55.88,48.26 59.69,48.26 60.33,48.9 60.33,50.8 60.96,51.44 64.77,51.44 65.41,50.8 65.41,30.98 72.5,23.88 U3.13
S8_2
  Top 0.203: RS8_2.1 54.92,55.24 55.24,55.24 55.88,54.61 59.69,54.61 60.33,55.24 60.33,57.15 60.96,57.78 65.76,57.78 66.4,57.15 66.4,31.28 72.79,24.88 72.8,24.88 U3.11
S9_2
  Top 0.203: RS9_2.1 54.92,61.59 55.24,61.59 55.88,60.96 59.69,60.96 60.33,61.59 60.33,63.5 60.96,64.14 66.67,64.14 67.31,63.5 67.31,31.66 73.09,25.88 | U3.9 73.09,25.88 | 73.09,25.88
S10_2
  Top 0.203: RS10_2.1 54.92,67.94 55.24,67.94 55.88,67.31 59.69,67.31 60.33,67.94 60.33,69.85 60.96,70.48 67.03,70.48 68.3,69.22 68.3,31.96 73.38,26.88 U3.7
S11_2
  Top 0.203: RS11_2.1 54.92,74.3 55.24,74.3 55.88,73.66 59.69,73.66 60.33,74.3 60.33,76.2 60.96,76.83 68.58,76.83 69.22,76.2 69.22,32.34 73.65,27.91 75.17,27.91 U3.5
S12_2
  Top 0.203: RS12_2.1 54.92,80.64 55.24,80.64 55.88,80.01 59.69,80.01 60.33,80.64 60.33,82.55 60.96,83.19 69.57,83.19 70.21,82.55 70.21,32.64 73.94,28.91 75.17,28.91 U3.3
V-_2  (via drill 0.53, 0.55 pad 1.1)
  Top 0.254: C17.2 v78.11,37.47 | C21.2 C20.2 C19.2 98.11,9.85 v99.06,10.79 | C18.2 102.23,16.51 102.94,15.81 v102.94,14.67
  Top 0.305: v80.64,20.95 80.72,20.88 U3.30 U3.31
  Top 0.508: R22.1 C17.2 | C22.2 v76.83,60.33 | v83.22,60.33 83.22,62 83.19,62.04 C23.2 | L2.2 56.97,6.49 C24.2 64.08,6.67 v64.77,7.36
  pour Bottom: 61.59,5.71 96.52,5.71 105.41,14.61 105.41,65.41 102.23,68.58 80.64,68.58 78.11,71.12 78.11,85.09 76.2,87 61.59,87
VREF1_C4_2
  Top 0.254: C20.1 93.34,13.34 92.71,13.97 92.71,21.59 92.08,22.23 87,22.23 85.86,23.36 82.56,23.36 82.53,23.38 U3.35
VREF2_C5_2  (via drill 0.55 pad 1.1)
  Top 0.254: U3.34 82.31,22.86 85.09,22.86 86.36,21.59 91.44,21.59 92.08,20.95 92.08,15.88 91.44,15.24 90.81,15.24 | 101.6,49.53 v101.6,42.55 100.69,41.64 RT1.P$1 | 101.6,49.53 101.6,57.78 101.23,58.15 RT3.P$1 | 90.81,15.24 C21.1 | 90.81,15.24 v90.17,15.24 | RT2.P$1 101.23,49.9 101.6,49.53
  Bottom 0.254: v90.17,15.24 91.44,15.24 92.71,16.51 92.71,33.02 93.34,33.66 100.97,33.66 101.6,34.29 v101.6,42.55
VREG_2
  Top 0.254: U3.37 82.31,24.36 | U3.40 81.31,25.88 80.7,25.27 80.7,24.58 81.4,23.88 U3.36 82.31,23.91 82.31,24.36 | 82.31,24.36 86.12,24.36 87.62,22.86 92.71,22.86 93.34,22.23 93.34,14.61 93.98,13.97 98.11,13.97 | DZT5551-2.E 99.33,14.24 99.06,13.97 98.11,13.97 | MOLEX_SL_70553-0002_3PIN.1 90.17,65.41 89.53,64.77 89.53,25.4 90.17,24.77 103.5,24.77 104.14,24.13 104.14,13.34 103.34,12.54 96.68,12.54 | C19.1 96.68,12.54 | 96.68,12.54 98.11,13.97
VREG_CAP_2  (via drill 0.55 pad 1.1)
  Top 0.254: 74.93,40.64 74.93,42.55 76.83,44.45 84.45,44.45 86.36,42.55 86.36,34.29 85.72,33.66 v84.45,33.66 | v88.27,25.4 88.27,24.77 88.9,24.13 94.59,24.13 DZT5551-2.C 101.49,21.7 102.23,20.95 C18.1
  Top 0.305: DZT5551-2.C@2 DZT5551-2.C | R24.1 74.93,40.64
  Bottom 0.305: v88.27,25.4 85.09,25.4 84.45,26.04 v84.45,33.66

### Text on the board
tPlace: M3 (typ) | lightly tighten | IPB | IPB | IMB | IMB | IPA | IMA | 5V | GPIO4 | V- | GPIO3 | V- | GPIO2 | V- | GPIO1 | V- | lightly tighten | WASHINGTON SUPERBIKE
tNames: HM2112ZNL PULSE | IPA | IMA | DZT5551-13 | LTC6811-1
tValues: LTC6811-1